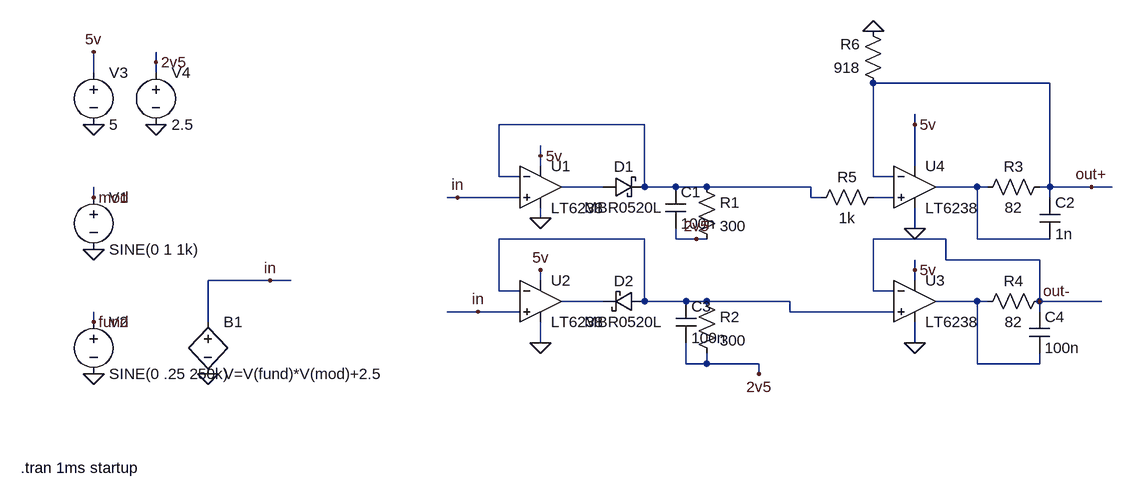
[diagram p0: schematic single_ended_envelope_lt6238_activeLP.asc]
single_ended_envelope_lt6238_activeLP.asc, the LTspice schematic file:
Version 4
SHEET 1 1448 680
WIRE -32 0 -32 -16
WIRE -128 16 -128 -16
WIRE -32 16 -32 0
WIRE 1344 32 1072 32
WIRE 720 96 496 96
WIRE 1136 96 1136 80
WIRE 560 144 560 128
WIRE 560 160 560 144
WIRE 1136 160 1136 96
WIRE 496 176 496 96
WIRE 528 176 496 176
WIRE 1072 176 1072 32
WIRE 1104 176 1072 176
WIRE 656 192 592 192
WIRE 720 192 720 96
WIRE 768 192 720 192
WIRE 816 192 768 192
WIRE 976 192 816 192
WIRE 1232 192 1168 192
WIRE 1248 192 1232 192
WIRE 1344 192 1344 32
WIRE 1344 192 1328 192
WIRE 1408 192 1344 192
WIRE 1440 192 1408 192
WIRE -128 208 -128 192
WIRE 432 208 416 208
WIRE 528 208 432 208
WIRE 976 208 976 192
WIRE 992 208 976 208
WIRE 1104 208 1072 208
WIRE 1344 208 1344 192
WIRE 560 240 560 224
WIRE 1136 256 1136 224
WIRE 720 272 496 272
WIRE 768 272 768 256
WIRE 800 272 768 272
WIRE 816 272 800 272
WIRE 1184 272 1072 272
WIRE 1232 272 1232 192
WIRE 1344 272 1232 272
WIRE 1184 304 1184 272
WIRE 1328 304 1184 304
WIRE 1136 320 1136 304
WIRE 144 336 48 336
WIRE 176 336 144 336
WIRE 560 336 560 320
WIRE 1136 336 1136 320
WIRE 496 352 496 272
WIRE 528 352 496 352
WIRE 1072 352 1072 272
WIRE 1104 352 1072 352
WIRE 656 368 592 368
WIRE 720 368 720 272
WIRE 784 368 720 368
WIRE 816 368 784 368
WIRE 944 368 816 368
WIRE 1232 368 1168 368
WIRE 1248 368 1232 368
WIRE 1328 368 1328 304
WIRE 1424 368 1328 368
WIRE 464 384 416 384
WIRE 528 384 464 384
WIRE 944 384 944 368
WIRE 1104 384 944 384
WIRE 1328 384 1328 368
WIRE -128 400 -128 384
WIRE 48 400 48 336
WIRE 560 432 560 400
WIRE 1136 432 1136 400
WIRE 784 464 784 432
WIRE 816 464 816 448
WIRE 816 464 784 464
WIRE 896 464 816 464
WIRE 1232 464 1232 368
WIRE 1328 464 1328 448
WIRE 1328 464 1232 464
WIRE 896 480 896 464
FLAG -128 288 0
FLAG -128 480 0
FLAG 48 480 0
FLAG -128 208 mod
FLAG -128 400 fund
FLAG 144 336 in
FLAG 560 240 0
FLAG 560 432 0
FLAG -128 96 0
FLAG -128 -16 5v
FLAG 560 320 5v
FLAG 560 144 5v
FLAG 1136 320 5v
FLAG 1136 256 0
FLAG 1136 432 0
FLAG -32 96 0
FLAG -32 0 2v5
FLAG 432 208 in
FLAG 464 384 in
FLAG 1136 96 5v
FLAG 896 480 2v5
FLAG 1328 368 out-
FLAG 1408 192 out+
FLAG 800 272 2v5
FLAG 1072 -48 0
SYMBOL voltage -128 192 R0
SYMATTR InstName V1
SYMATTR Value SINE(0 1 1k)
SYMBOL voltage -128 384 R0
SYMATTR InstName V2
SYMATTR Value SINE(0 .25 250k)
SYMBOL bv 48 384 R0
SYMATTR InstName B1
SYMATTR Value V=V(fund)*V(mod)+2.5
SYMBOL voltage -128 0 R0
SYMATTR InstName V3
SYMATTR Value 5
SYMBOL schottky 656 208 R270
WINDOW 0 32 32 VTop 2
WINDOW 3 0 32 VBottom 2
SYMATTR InstName D1
SYMATTR Value MBR0520L
SYMATTR Description Diode
SYMATTR Type diode
SYMBOL schottky 720 352 R90
WINDOW 0 0 32 VBottom 2
WINDOW 3 32 32 VTop 2
SYMATTR InstName D2
SYMATTR Value MBR0520L
SYMATTR Description Diode
SYMATTR Type diode
SYMBOL cap 752 192 R0
SYMATTR InstName C1
SYMATTR Value 100n
SYMBOL cap 768 368 R0
SYMATTR InstName C3
SYMATTR Value 100n
SYMBOL res 800 176 R0
SYMATTR InstName R1
SYMATTR Value 300
SYMBOL res 800 352 R0
SYMATTR InstName R2
SYMATTR Value 300
SYMBOL res 1344 176 R90
WINDOW 0 0 56 VBottom 2
WINDOW 3 32 56 VTop 2
SYMATTR InstName R3
SYMATTR Value 82
SYMBOL res 1344 352 R90
WINDOW 0 0 56 VBottom 2
WINDOW 3 32 56 VTop 2
SYMATTR InstName R4
SYMATTR Value 82
SYMBOL cap 1328 208 R0
SYMATTR InstName C2
SYMATTR Value 1n
SYMBOL cap 1312 384 R0
SYMATTR InstName C4
SYMATTR Value 100n
SYMBOL voltage -32 0 R0
SYMATTR InstName V4
SYMATTR Value 2.5
SYMBOL Opamps/LT6238 560 192 R0
SYMATTR InstName U1
SYMBOL Opamps/LT6238 560 368 R0
SYMATTR InstName U2
SYMBOL Opamps/LT6238 1136 368 R0
SYMATTR InstName U3
SYMBOL Opamps/LT6238 1136 192 R0
SYMATTR InstName U4
SYMBOL res 1088 192 R90
WINDOW 0 0 56 VBottom 2
WINDOW 3 32 56 VTop 2
SYMATTR InstName R5
SYMATTR Value 1k
SYMBOL res 1088 48 R180
WINDOW 0 36 76 Left 2
WINDOW 3 36 40 Left 2
SYMATTR InstName R6
SYMATTR Value 918
TEXT -240 624 Left 2 !.tran 1ms startup

The netlist it stands for:
* single_ended_envelope_lt6238_activeLP.asc
V1 mod 0 SINE(0 1 1k)
V2 fund 0 SINE(0 .25 250k)
B1 in 0 V=V(fund)*V(mod)+2.5
V3 5v 0 5
D1 N002 N001 MBR0520L
D2 N005 N006 MBR0520L
C1 N001 2v5 100n
C3 N005 2v5 100n
R1 N001 2v5 300
R2 N005 2v5 300
R3 out+ N003 82
R4 out- N007 82
C2 out+ N003 1n
C4 out- N007 100n
V4 2v5 0 2.5
* U1: LT6238 (symbol Opamps/LT6238 not available, pins judged from their places): In+=in In-=N001 V+=5v V-=0 OUT=N002
* U2: LT6238 (symbol Opamps/LT6238 not available, pins judged from their places): In+=in In-=N005 V+=5v V-=0 OUT=N006
* U3: LT6238 (symbol Opamps/LT6238 not available, pins judged from their places): In+=N005 In-=out- V+=5v V-=0 OUT=N007
* U4: LT6238 (symbol Opamps/LT6238 not available, pins judged from their places): In+=N004 In-=out+ V+=5v V-=0 OUT=N003
R5 N004 N001 1k
R6 out+ 0 918
.model D D
.lib standard.dio
.tran 1ms startup
.backanno
.end